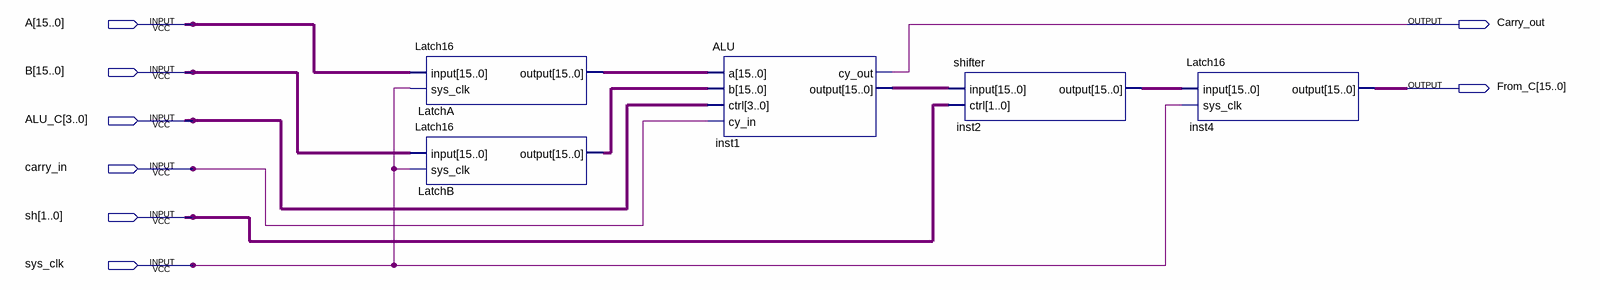
[diagram p0: schematic sheet]
// Quartus schematic LatchAluShift.bdf as structural Verilog: 5 symbols, 8 pins
module LatchAluShift (
  input  [15:0] A,
  input  [15:0] B,
  input  [3:0] ALU_C,
  input  carry_in,
  input  [1:0] sh,
  input  sys_clk,
  output Carry_out,
  output [15:0] From_C
);

  wire [15:0] inst1_output, inst2_output, LatchA_output, LatchB_output;

  Latch16 LatchA (.\input (A), .sys_clk(sys_clk), .\output (LatchA_output));
  Latch16 LatchB (.\input (B), .sys_clk(sys_clk), .\output (LatchB_output));
  ALU inst1 (
    .a(LatchA_output), .b(LatchB_output), .ctrl(ALU_C), .cy_in(carry_in), .cy_out(Carry_out),
    .\output (inst1_output));
  shifter inst2 (.\input (inst1_output), .ctrl(sh), .\output (inst2_output));
  Latch16 inst4 (.\input (inst2_output), .sys_clk(sys_clk), .\output (From_C));
endmodule
